# EAGLE design V1_DIL (EAGLE 8.7.0)
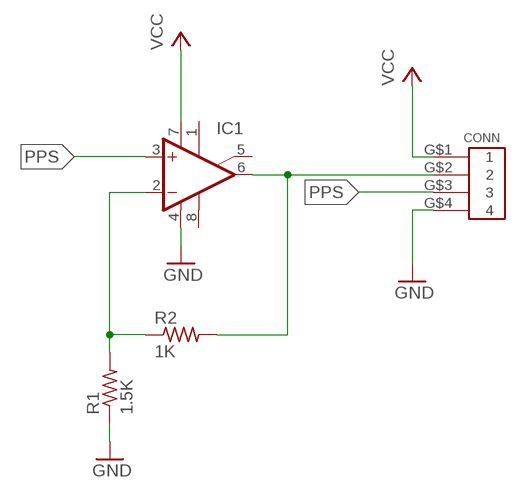
[diagram p0: schematic, sheet 1]

## Parts
CONN  OSTVN04A150  [OSTVN04A150]
IC1  LM741P  [DIL08]
R1  1.5K  R-US_0204/7  [0204/7]
R2  1K  R-US_0204/7  [0204/7]

## Nets
GND: CONN.G$4 IC1.4(V-) R1.1
IN-: IC1.2(-IN) R1.2 R2.1
OUT: CONN.G$2 IC1.6(OUT) R2.2
PPS: CONN.G$3 IC1.3(+IN)
VCC: CONN.G$1 IC1.7(V+)
Unconnected: IC1.1(ON1) IC1.5(ON2) IC1.8(OPT)

## Library data of the parts
CONN = myLibrary:OSTVN04A150
IC1 = linear:*741: OP AMP
R1 R2 = rcl:R-US_: RESISTOR, American symbol; SPICEPREFIX: R

## Board
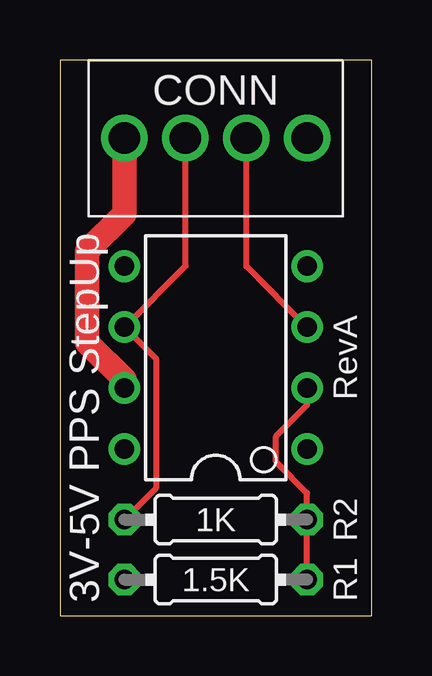
[diagram p1: board, top side]
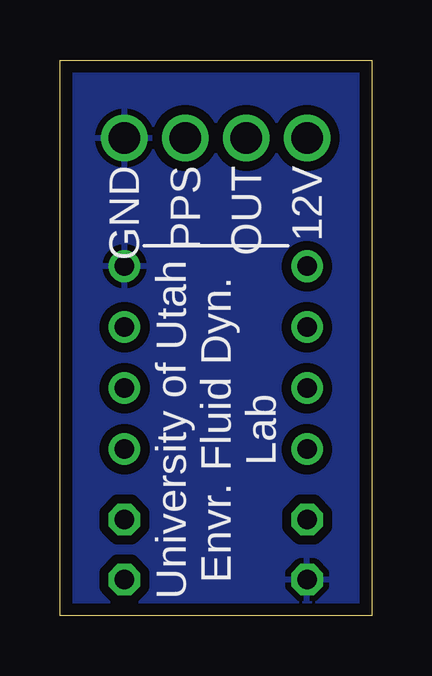
[diagram p2: board, bottom side, seen from below]

Size 13 x 23.15 mm. Coordinates in mm from the lower left corner, seen from the top.
Outline: 0,0 13,0 13,23.15 0,23.15 0,0
Copper layers (1*16): Top 0.035mm / dielectric 1.5mm / Bottom 0.035mm
Design rules "default *": minimum track width 6mil, minimum drill 10mil, track to track 15mil, track to pad 15mil, pad to pad 15mil, via to via 15mil, smd to smd 6mil, copper to edge 20mil, drill to drill 6mil, minimum pad ring 10mil, minimum via ring 8mil, stop-mask expansion 4mil, vias tented up to drill 0mil, thermal gap 10mil

### Footprints (pad centres in the part's own frame; a part is rotated, then mirrored left to right if it is on the bottom)
OSTVN04A150 = drill 1.3: G$1 -3.81,0; G$2 -1.27,0; G$3 1.27,0; G$4 3.81,0
DIL08 = drill 0.813 pad 1.27: 1 -3.81,-3.81; 2 -1.27,-3.81; 3 1.27,-3.81; 4 3.81,-3.81; 5 3.81,3.81; 6 1.27,3.81; 7 -1.27,3.81; 8 -3.81,3.81
0204/7 = drill 0.813 octagon: 1 -3.81,0; 2 3.81,0

### Placement (x,y rotation side)
CONN  6.5,19.9 0 top
IC1  6.5,10.75 90 top
R1  6.5,1.5 0 top
R2  6.5,4 180 top

### Tracks (layer width: path | path; a pad name or v marks a point on that pad's centre or on a via)
GND
  pour Bottom: -1,24 14,24 14,-1 -1,-1
IN-
  Top 0.254: R1.2 R2.1 10.31,5.11 9.02,6.4 9.02,7.48 10.31,8.77 IC1.2
OUT
  Top 0.254: R2.2 4,5.31 4,10.71 IC1.6 5.24,14.57 CONN.G$2
PPS
  Top 0.254: IC1.3 7.78,14.55 CONN.G$3
VCC
  Top 1.016: CONN.G$1 2.69,16.75 1.14,15.2 1.14,11.38 2.69,9.83 IC1.7

### Text on the board
tPlace: RevA | 3V-5V PPS StepUp
bPlace: 12V | OUT | PPS | GND | University of Utah / Envr. Fluid Dyn. / Lab